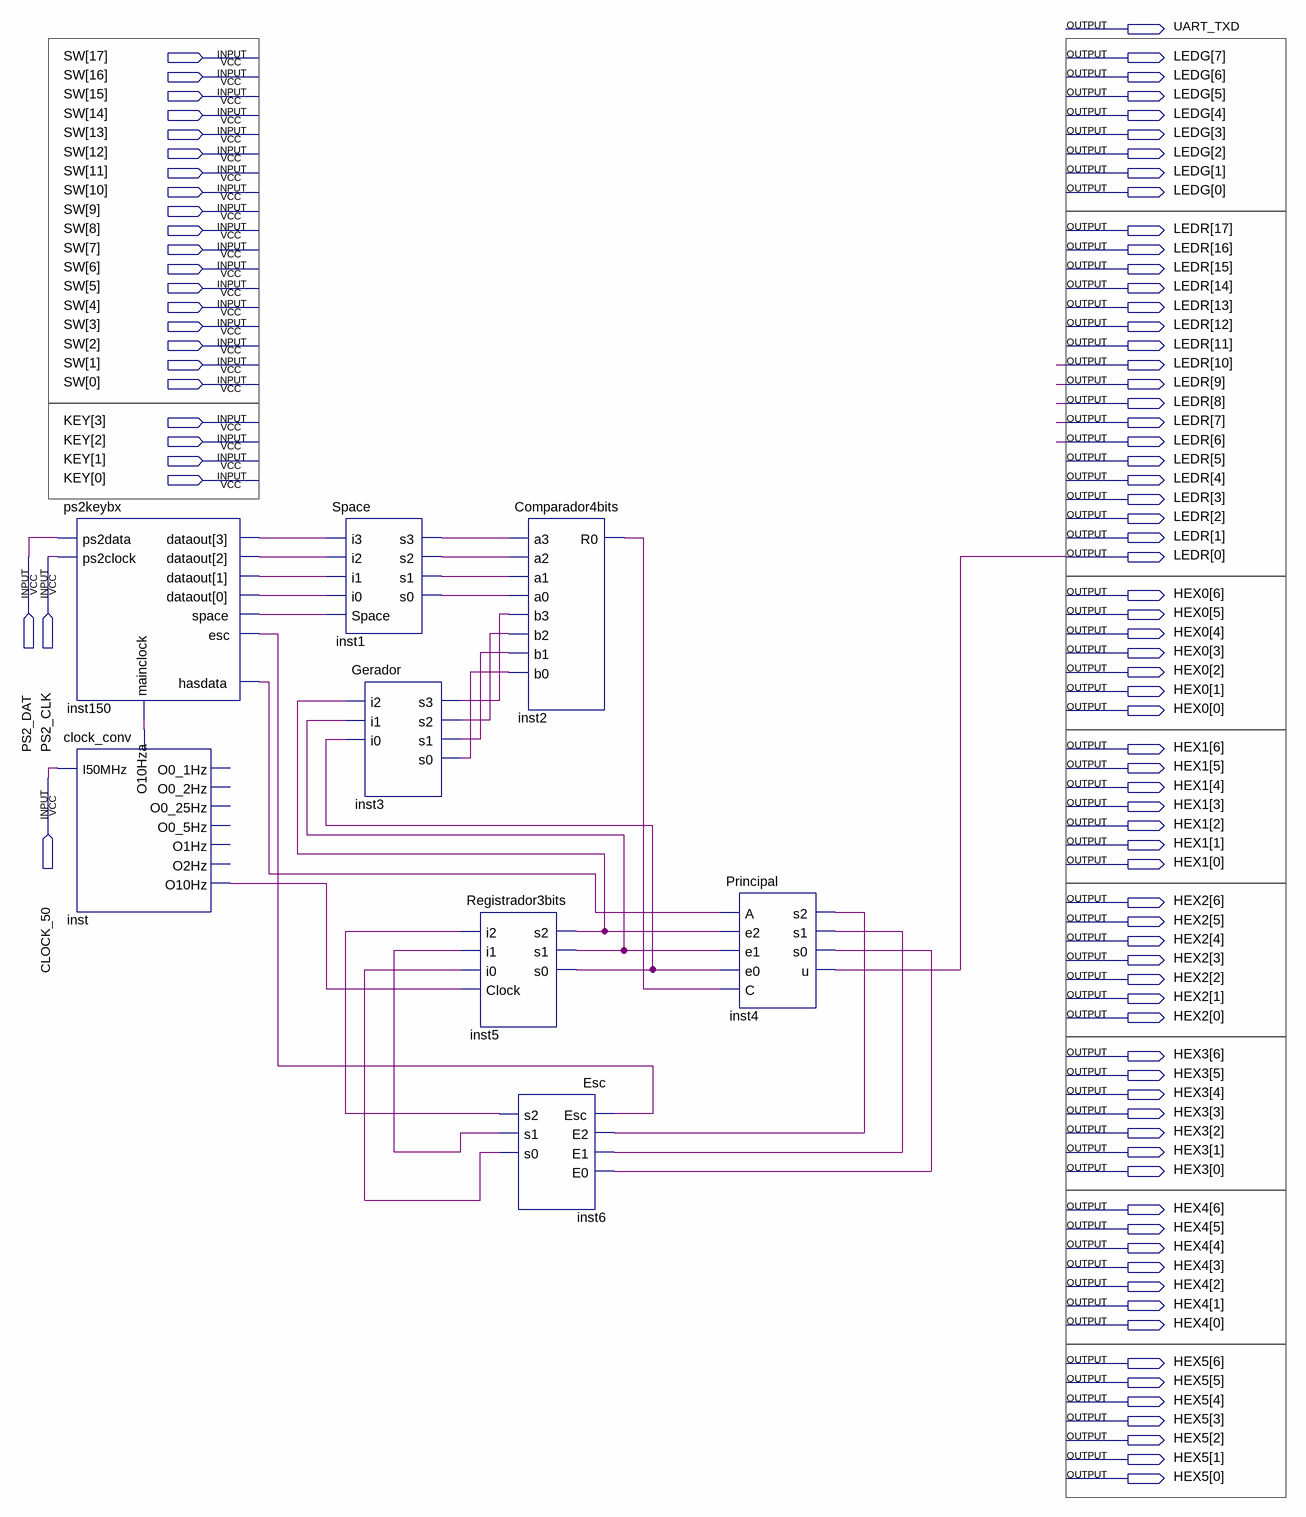
[diagram p0: schematic sheet]
// Quartus schematic ProjetoFinal.bdf as structural Verilog: 8 symbols, 94 pins
module ProjetoFinal (
  input  [17:0] SW,
  input  [3:0] KEY,
  input  PS2_DAT,
  input  PS2_CLK,
  input  CLOCK_50,
  output UART_TXD,
  output [7:0] LEDG,
  output [17:0] LEDR,
  output [6:0] HEX0,
  output [6:0] HEX1,
  output [6:0] HEX2,
  output [6:0] HEX3,
  output [6:0] HEX4,
  output [6:0] HEX5
);

  wire inst1_s0, inst1_s1, inst1_s2, inst1_s3, inst2_r0, inst3_s0, inst3_s1, inst3_s2, inst3_s3, inst4_s0,
       inst4_s1, inst4_s2, inst5_s0, inst5_s1, inst5_s2, inst6_s0, inst6_s1, inst6_s2, inst150_dataout,
       inst150_dataout_2, inst150_dataout_3, inst150_dataout_4, inst150_esc, inst150_hasdata, inst150_space,
       inst_o10hz, inst_o10hza;

  ps2keybx inst150 (
    .ps2data(PS2_DAT), .ps2clock(PS2_CLK), .mainclock(inst_o10hza),
    .dataout({inst150_dataout, inst150_dataout_2, inst150_dataout_3, inst150_dataout_4}),
    .hasdata(inst150_hasdata), .space(inst150_space), .esc(inst150_esc));
  clock_conv inst (
    .I50MHz(CLOCK_50), .O10Hz(inst_o10hz), .O10Hza(inst_o10hza));  // open: O0_1Hz, O0_2Hz, O0_25Hz, O0_5Hz, O1Hz, O2Hz
  Space inst1 (
    .i3(inst150_dataout), .i2(inst150_dataout_2), .i1(inst150_dataout_3), .i0(inst150_dataout_4),
    .Space(inst150_space), .s3(inst1_s3), .s2(inst1_s2), .s1(inst1_s1), .s0(inst1_s0));
  Gerador inst3 (
    .i2(inst5_s2), .i1(inst5_s1), .i0(inst5_s0), .s3(inst3_s3), .s2(inst3_s2), .s1(inst3_s1), .s0(inst3_s0));
  Registrador3bits inst5 (
    .i2(inst6_s2), .i1(inst6_s1), .i0(inst6_s0), .Clock(inst_o10hz), .s2(inst5_s2), .s1(inst5_s1),
    .s0(inst5_s0));
  Comparador4bits inst2 (
    .a3(inst1_s3), .a2(inst1_s2), .a1(inst1_s1), .a0(inst1_s0), .b3(inst3_s3), .b2(inst3_s2), .b1(inst3_s1),
    .b0(inst3_s0), .R0(inst2_r0));
  Esc inst6 (
    .Esc(inst150_esc), .E2(inst4_s2), .E1(inst4_s1), .E0(inst4_s0), .s2(inst6_s2), .s1(inst6_s1),
    .s0(inst6_s0));
  Principal inst4 (
    .A(inst150_hasdata), .e2(inst5_s2), .e1(inst5_s1), .e0(inst5_s0), .C(inst2_r0), .s2(inst4_s2),
    .s1(inst4_s1), .s0(inst4_s0), .u(LEDR[0]));
endmodule
